# EAGLE design MODULO_LM35 (EAGLE 7.5.0)
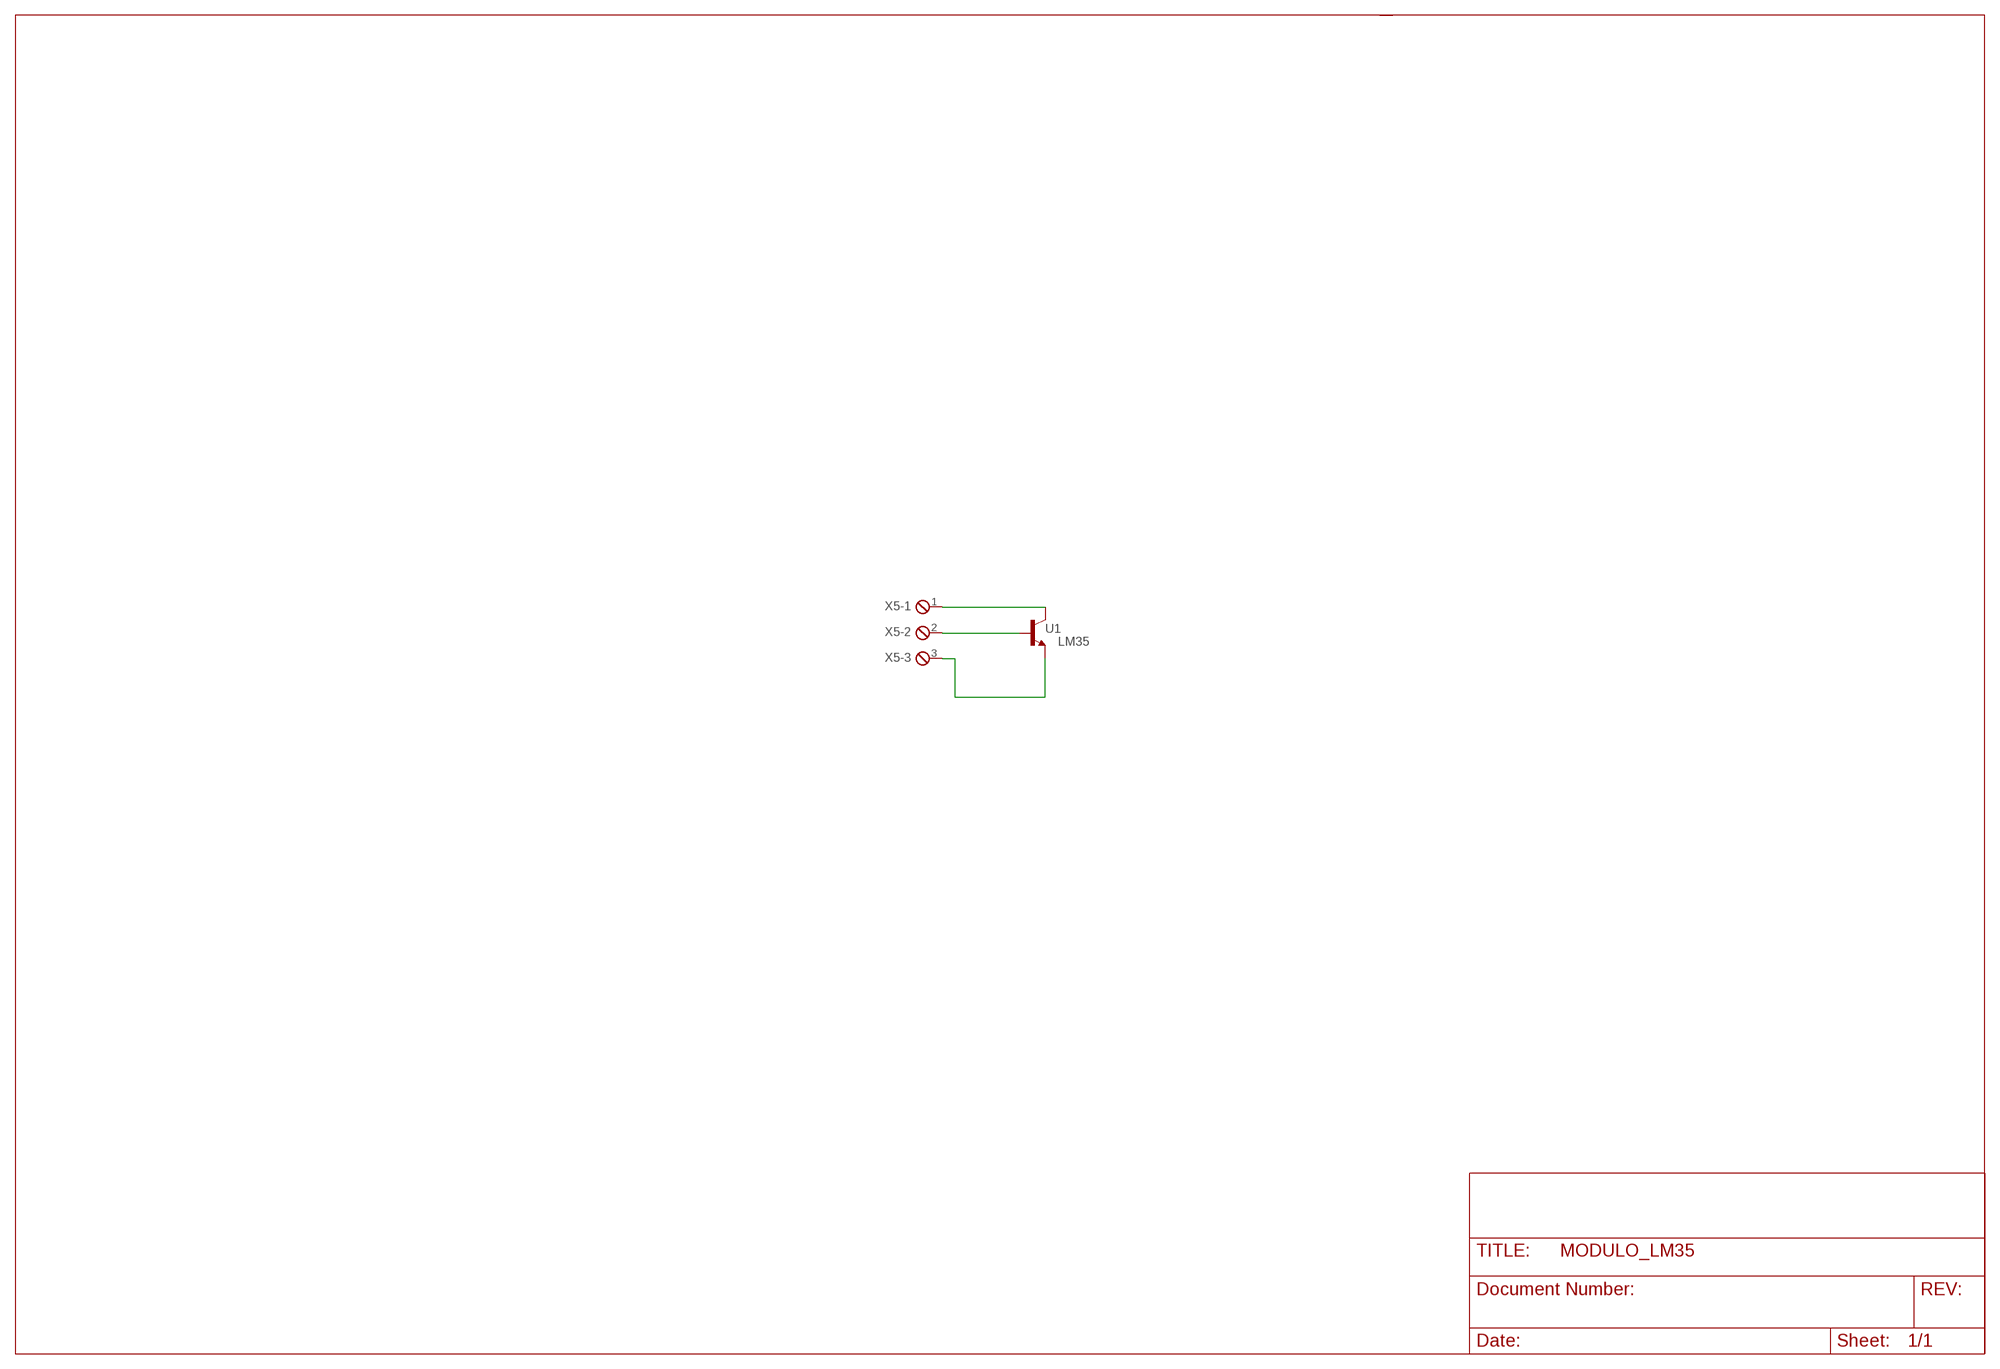
[diagram p0: schematic, sheet 1]

## Parts
U1  LM35  BC548  [TO92-EBC]
X5  MPT3  [3POL254]

## Nets
N$31: U1.C X5.1
N$33: U1.E X5.3
N$34: U1.B X5.2

## Library data of the parts
U1 = transistor-npn:BC548*: NPN Transistor
X5 = con-phoenix-254:MPT3: PHOENIX CONNECTOR; OC_FARNELL: unknown; OC_NEWARK: unknown

## Board
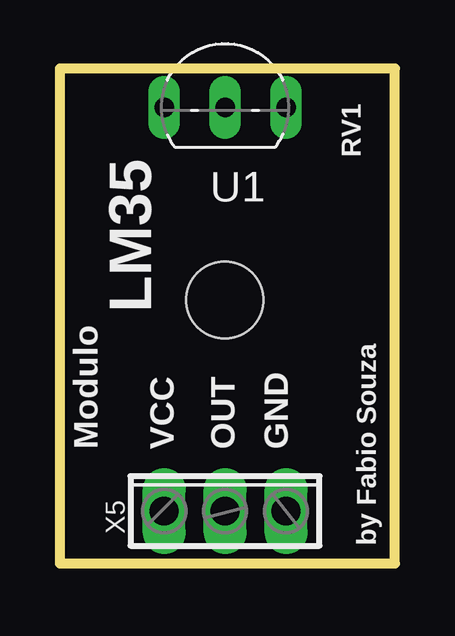
[diagram p1: board, top side]
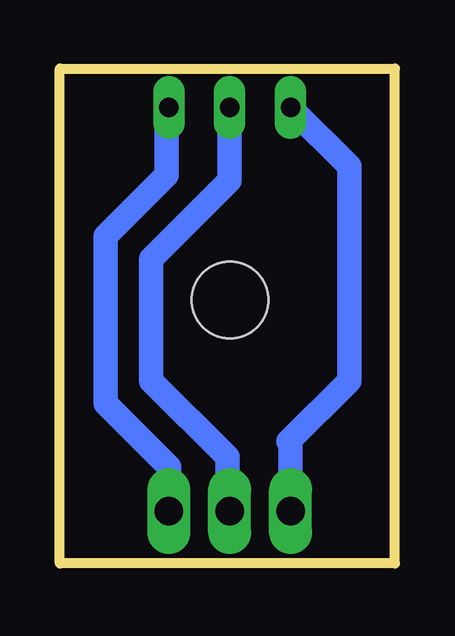
[diagram p2: board, bottom side, seen from below]

Size 13.97 x 20.64 mm. Coordinates in mm from the lower left corner, seen from the top.
Outline: 0,0 13.97,0 13.97,20.64 0,20.64 0,0
Copper layers (1*16): Top 0.035mm / dielectric 1.5mm / Bottom 0.035mm
Design rules "default": minimum track width 10mil, minimum drill 24mil, track to track 8mil, track to pad 8mil, pad to pad 8mil, via to via 8mil, smd to smd 8mil, copper to edge 40mil, drill to drill 8mil, minimum pad ring 10mil, minimum via ring 8mil, stop-mask expansion 4mil, vias tented up to drill 0mil, thermal gap 10mil
Holes 3.2 mm at 6.87,10.98

### Footprints (pad centres in the part's own frame; a part is rotated, then mirrored left to right if it is on the bottom)
TO92-EBC = drill 0.813 long: B 0,-1.27; C -2.54,-1.27; E 2.54,-1.27
3POL254 = drill 1.2 long: 1 -2.54,0; 2 0,0; 3 2.54,0

### Placement (x,y rotation side)
U1  6.89,20.29 0 top
X5  6.89,2.19 0 top

### Tracks (layer width: path | path; a pad name or v marks a point on that pad's centre or on a via)
N$31
  Bottom 1.016: U1.C 1.91,16.57 1.91,7.62 4.45,5.08 4.35,4.98 X5.1
N$33
  Bottom 1.016: X5.3 9.43,4.03 12.06,6.67 12.06,13.65 9.53,16.19 9.53,18.92 U1.E
N$34
  Bottom 1.016: U1.B 6.89,15.97 10.16,12.7 10.16,7.62 6.99,4.45 6.99,2.29 X5.2

### Text on the board
tPlace: RV1 | LM35 | Modulo | VCC | OUT | GND | by Fabio Souza